# EAGLE design minimal_kl05z (EAGLE 6.6.0)
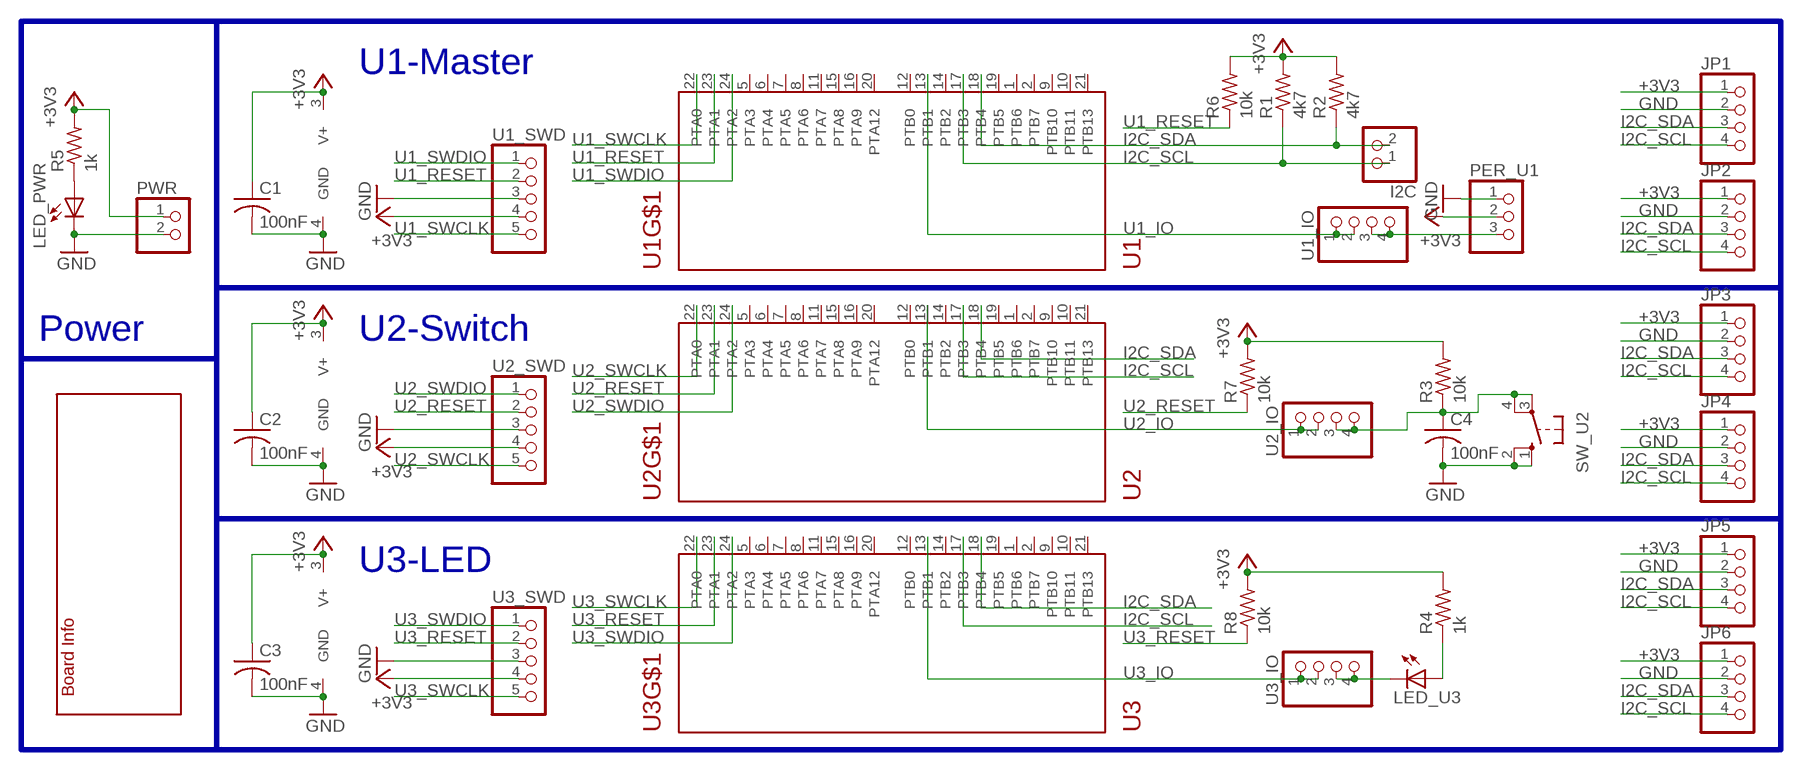
[diagram p0: schematic, sheet 1]

## Parts
C1  100nF  C-US025-025X050  [C025-025X050]
C2  100nF  C-US025-025X050  [C025-025X050]
C3  100nF  C-US025-025X050  [C025-025X050]
C4  100nF  C-US025-025X050  [C025-025X050]
I2C  PINHD-1X2  [1X02]
JP1  PINHD-1X4  [1X04]
JP2  PINHD-1X4  [1X04]
JP3  PINHD-1X4  [1X04]
JP4  PINHD-1X4  [1X04]
JP5  PINHD-1X4  [1X04]
JP6  PINHD-1X4  [1X04]
LED_PWR  LED5MM  [LED5MM]
LED_U3  LED5MM  [LED5MM]
PER_U1  PINHD-1X3  [1X03]
PWR  PINHD-1X2  [1X02]
R1  4k7  R-US_0204/7  [0204/7]
R2  4k7  R-US_0204/7  [0204/7]
R3  10k  R-US_0204/2V  [0204V]
R4  1k  R-US_0204/2V  [0204V]
R5  1k  R-US_0204/2V  [0204V]
R6  10k  R-US_0204/7  [0204/7]
R7  10k  R-US_0204/7  [0204/7]
R8  10k  R-US_0204/7  [0204/7]
SW_U2  10-XX  [B3F-10XX]
U1  MKL05Z32VFK4-DIP  [DIL24-3]
U1_IO  PINHD-1X4  [1X04]
U1_SWD  PINHD-1X5  [1X05]
U2  MKL05Z32VFK4-DIP  [DIL24-3]
U2_IO  PINHD-1X4  [1X04]
U2_SWD  PINHD-1X5  [1X05]
U3  MKL05Z32VFK4-DIP  [DIL24-3]
U3_IO  PINHD-1X4  [1X04]
U3_SWD  PINHD-1X5  [1X05]
U$1  INFO  [INFO]

## Nets
+3V3: C1.1 C2.1 C3.1 JP1.1 JP2.1 JP3.1 JP4.1 JP5.1 JP6.1 PER_U1.2 PWR.1 R1.2 R2.2 R3.2 R4.2 R5.2 R6.2 R7.2 R8.2 U1.3(V+) U1_SWD.4 U2.3(V+) U2_SWD.4 U3.3(V+) U3_SWD.4
GND: C1.2 C2.2 C3.2 C4.2 JP1.2 JP2.2 JP3.2 JP4.2 JP5.2 JP6.2 LED_PWR.K(C) PER_U1.1 PWR.2 SW_U2.1(S) SW_U2.2(S1) U1.4(GND) U1_SWD.3 U2.4(GND) U2_SWD.3 U3.4(GND) U3_SWD.3
I2C_SCL: I2C.1 JP1.4 JP2.4 JP3.4 JP4.4 JP5.4 JP6.4 R1.1 U1.17(PTB3) U2.17(PTB3) U3.17(PTB3)
I2C_SDA: I2C.2 JP1.3 JP2.3 JP3.3 JP4.3 JP5.3 JP6.3 R2.1 U1.18(PTB4) U2.18(PTB4) U3.18(PTB4)
N$1: LED_PWR.A R5.1
N$2: C4.1 R3.1 SW_U2.3(P) SW_U2.4(P1) U2_IO.3 U2_IO.4
N$3: PER_U1.3 U1_IO.3 U1_IO.4
N$4: LED_U3.A R4.1
N$5: LED_U3.K(C) U3_IO.3 U3_IO.4
U1_IO: U1.13(PTB1) U1_IO.1 U1_IO.2
U1_RESET: R6.1 U1.23(PTA1) U1_SWD.2
U1_SWCLK: U1.22(PTA0) U1_SWD.5
U1_SWDIO: U1.24(PTA2) U1_SWD.1
U2_IO: U2.13(PTB1) U2_IO.1 U2_IO.2
U2_RESET: R7.1 U2.23(PTA1) U2_SWD.2
U2_SWCLK: U2.22(PTA0) U2_SWD.5
U2_SWDIO: U2.24(PTA2) U2_SWD.1
U3_IO: U3.13(PTB1) U3_IO.1 U3_IO.2
U3_RESET: R8.1 U3.23(PTA1) U3_SWD.2
U3_SWCLK: U3.22(PTA0) U3_SWD.5
U3_SWDIO: U3.24(PTA2) U3_SWD.1
Unconnected: U1.1(PTB6) U1.2(PTB7) U1.5(PTA3) U1.6(PTA4) U1.7(PTA5) U1.8(PTA6) U1.9(PTB10) U1.10(PTB11) U1.11(PTA7) U1.12(PTB0) U1.14(PTB2) U1.15(PTA8) U1.16(PTA9) U1.19(PTB5) U1.20(PTA12) U1.21(PTB13) U2.1(PTB6) U2.2(PTB7) U2.5(PTA3) U2.6(PTA4) U2.7(PTA5) U2.8(PTA6) U2.9(PTB10) U2.10(PTB11) U2.11(PTA7) U2.12(PTB0) U2.14(PTB2) U2.15(PTA8) U2.16(PTA9) U2.19(PTB5) U2.20(PTA12) U2.21(PTB13) U3.1(PTB6) U3.2(PTB7) U3.5(PTA3) U3.6(PTA4) U3.7(PTA5) U3.8(PTA6) U3.9(PTB10) U3.10(PTB11) U3.11(PTA7) U3.12(PTB0) U3.14(PTB2) U3.15(PTA8) U3.16(PTA9) U3.19(PTB5) U3.20(PTA12) U3.21(PTB13)

## Buses
B$1

## Notes on the sheet
- U1-Master
- Power | U2-Switch
- U3-LED

## Library data of the parts
C1-C4 = rcl:C-US: CAPACITOR, American symbol
I2C PWR = pinhead:PINHD-1X2: PIN HEADER
JP1-JP6 U1_IO U2_IO U3_IO = pinhead:PINHD-1X4: PIN HEADER
LED_PWR LED_U3 = led:LED: LED OSRAM: - CHIPLED LG R971, LG N971, LY N971, LG Q971, LY Q971, LO R971, LY R971 LH N974, LH R974 LS Q976, LO Q976, LY Q976 LO Q996 - Hyper CHIPLED LW Q18S LB Q993, LB Q99A, LB R99A - SideLED LS A670, LO A670, LY A670, LG A670, LP A670 LB A673, LV A673, LT A673, LW A673 LH A674 LY A675 LS A676, LA A676, LO A676, LY A676, LW A676 LS A679, LY A679, LG A679 - Hyper Micro SIDELED® LS Y876, LA Y876, LO Y876, LY Y876 LT Y87S - SmartLED LW L88C, LW L88S LB L89C, LB L89S, LG L890 LS L89K, LO L89K, LY L89K LS L896, LA L896, LO L896, LY L896 - TOPLED LS T670, LO T670, LY T670, LG T670, LP T670 LSG T670, LSP T670, LSY T670, LOP T670, LYG T670 LG T671, LOG T671, LSG T671 LB T673, LV T673, LT T673, LW T673 LH T674 LS T676, LA T676, LO T676, LY T676, LB T676, LH T676, LSB T676, LW T676 LB T67C, LV T67C, LT T67C, LS T67K, LO T67K, LY T67K, LW E67C LS E67B, LA E67B, LO E67B, LY E67B, LB E67C, LV E67C, LT E67C LW T67C LS T679, LY T679, LG T679 LS T770, LO T770, LY T770, LG T770, LP T770 LB T773, LV T773, LT T773, LW T773 LH T774 LS E675, LA E675, LY E675, LS T675 LS T776, LA T776, LO T776, LY T776, LB T776 LHGB T686 LT T68C, LB T68C - Hyper Mini TOPLED® LB M676 - Mini TOPLED Santana® LG M470 LS M47K, LO M47K, LY M47K Source: http://www.osram.convergy.de LUXEON: - LUMILED® LXK2-PW12-R00, LXK2-PW12-S00, LXK2-PW14-U00, LXK2-PW14-V00 LXK2-PM12-R00, LXK2-PM12-S00, LXK2-PM14-U00 LXK2-PE12-Q00, LXK2-PE12-R00, LXK2-PE12-S00, LXK2-PE14-T00, LXK2-PE14-U00 LXK2-PB12-K00, LXK2-PB12-L00, LXK2-PB12-M00, LXK2-PB14-N00, LXK2-PB14-P00, LXK2-PB14-Q00 LXK2-PR12-L00, LXK2-PR12-M00, LXK2-PR14-Q00, LXK2-PR14-R00 LXK2-PD12-Q00, LXK2-PD12-R00, LXK2-PD12-S00 LXK2-PH12-R00, LXK2-PH12-S00 LXK2-PL12-P00, LXK2-PL12-Q00, LXK2-PL12-R00 Source: www.luxeon.com KINGBRIGHT: KA-3528ASYC Source: www.kingbright.com
PER_U1 = pinhead:PINHD-1X3: PIN HEADER
R1-R8 = rcl:R-US_: RESISTOR, American symbol
SW_U2 = switch-omron:10-XX: OMRON SWITCH; MPN: B3F-1000; OC_FARNELL: 176432; OC_NEWARK: 36M3542
U1-U3 = modular_robotics:MKL05Z32VFK4
U1_SWD U2_SWD U3_SWD = pinhead:PINHD-1X5: PIN HEADER
U$1 = modular_robotics:INFO; AUTHOR: Austin Buchan; DATE: Jul 7, 2015; DESIGN: MinimalKL05Z; ORGANIZATION: UC Berkeley ASPIRE; REVISION: r0.0

## Board
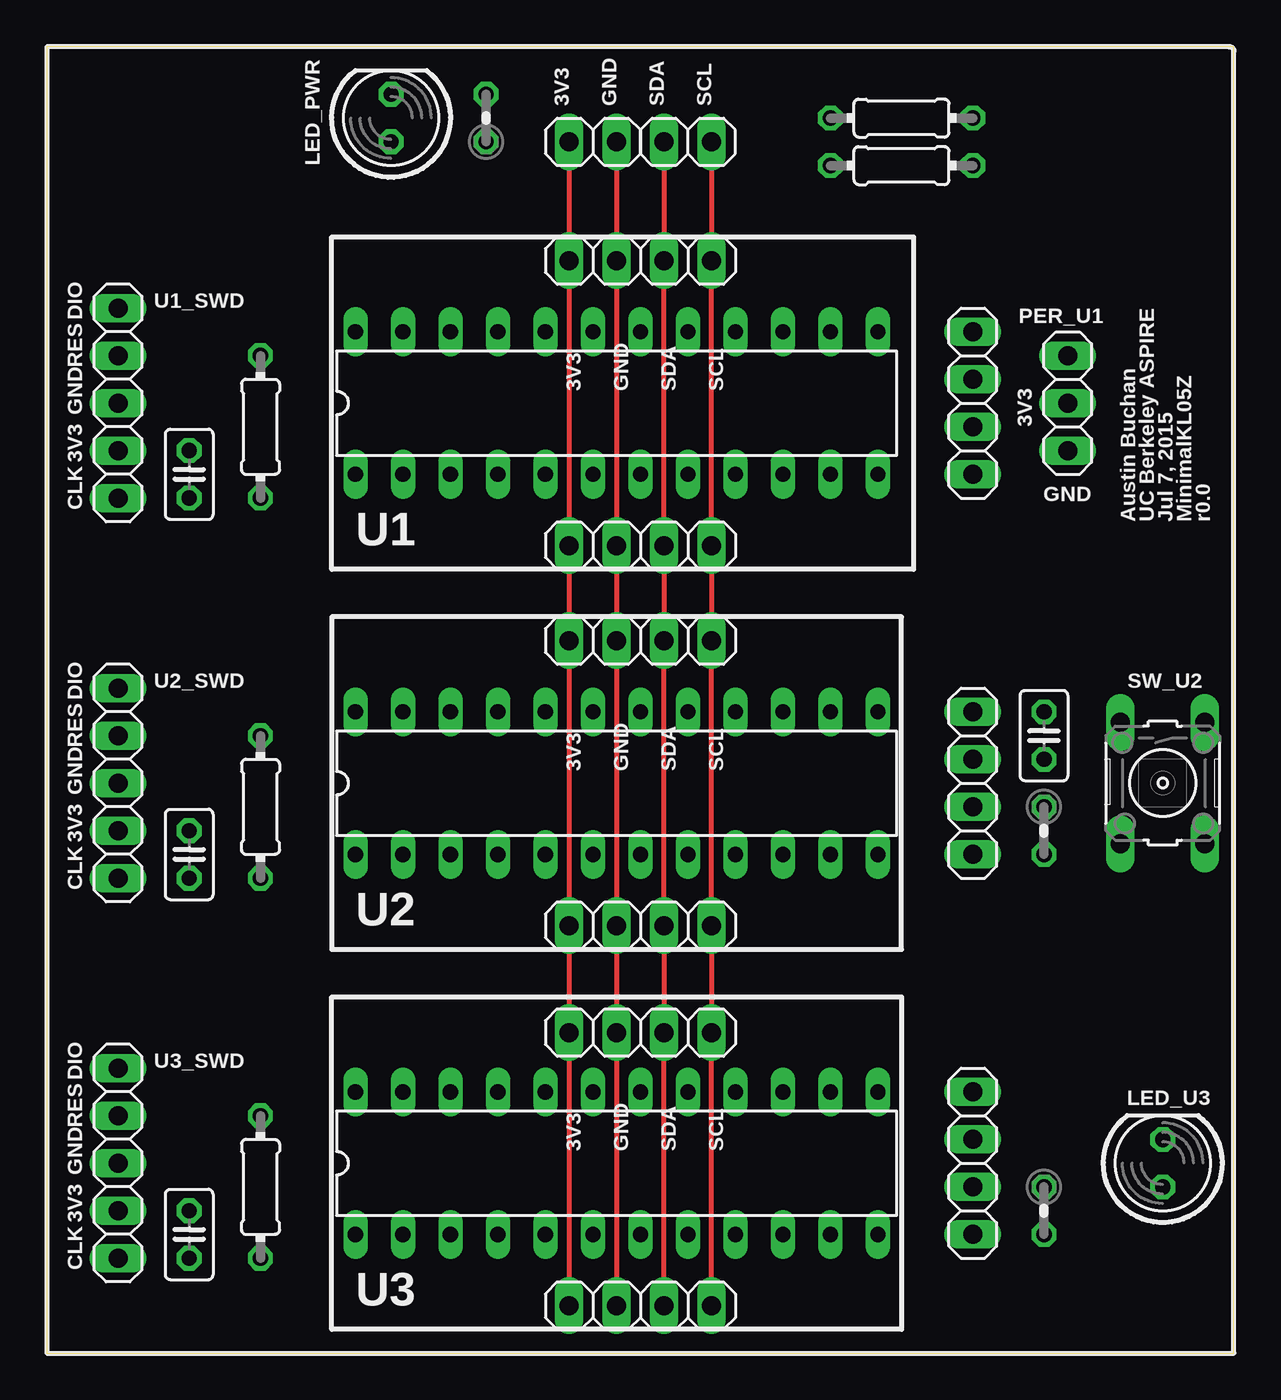
[diagram p1: board, top side]
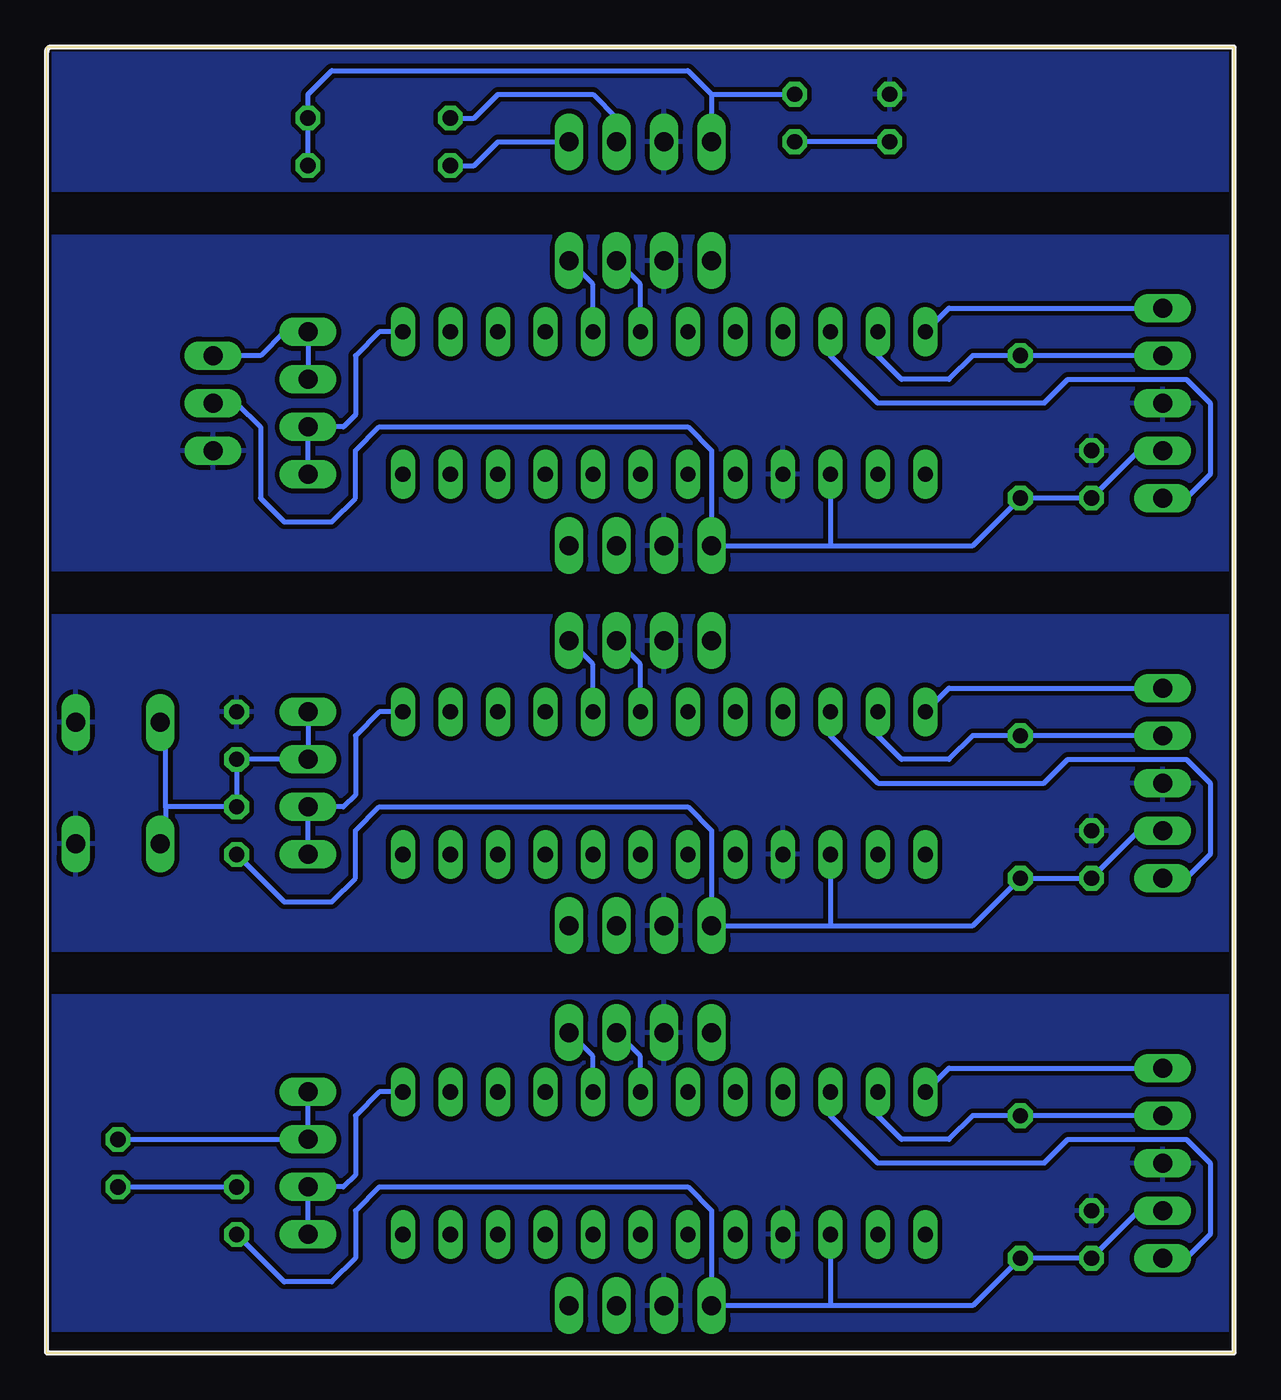
[diagram p2: board, bottom side, seen from below]

Size 63.5 x 69.85 mm. Coordinates in mm from the lower left corner, seen from the top.
Outline: 0,0 63.5,0 63.5,69.85 0,69.85 0,0
Copper layers (1*16): Top 0.035mm / dielectric 1.5mm / Bottom 0.035mm
Design rules "default *": minimum track width 10mil, minimum drill 24mil, track to track 10mil, track to pad 10mil, pad to pad 10mil, via to via 10mil, smd to smd 10mil, copper to edge 10mil, drill to drill 10mil, minimum pad ring 10mil, minimum via ring 8mil, stop-mask expansion 4mil, vias tented up to drill 0mil, thermal gap 10mil

### Footprints (pad centres in the part's own frame; a part is rotated, then mirrored left to right if it is on the bottom)
C025-025X050 = drill 0.813 octagon: 1 -1.27,0; 2 1.27,0
1X02 = drill 1.016 long: 1 -1.27,0; 2 1.27,0
1X04 = drill 1.016 long: 1 -3.81,0; 2 -1.27,0; 3 1.27,0; 4 3.81,0
LED5MM = drill 0.813 octagon: A -1.27,0; K 1.27,0
1X03 = drill 1.016 long: 1 -2.54,0; 2 0,0; 3 2.54,0
0204/7 = drill 0.813 octagon: 1 -3.81,0; 2 3.81,0
0204V = drill 0.813 octagon: 1 -1.27,0; 2 1.27,0
B3F-10XX = drill 1.016 long: 1 -3.251,2.261; 2 3.251,2.261; 3 -3.251,-2.261; 4 3.251,-2.261
DIL24-3 = drill 0.813 long: 1 -13.97,-3.81; 2 -11.43,-3.81; 3 -8.89,-3.81; 4 -6.35,-3.81; 5 -3.81,-3.81; 6 -1.27,-3.81; 7 1.27,-3.81; 8 3.81,-3.81; 9 6.35,-3.81; 10 8.89,-3.81; 11 11.43,-3.81; 12 13.97,-3.81; 13 13.97,3.81; 14 11.43,3.81; 15 8.89,3.81; 16 6.35,3.81; 17 3.81,3.81; 18 1.27,3.81; 19 -1.27,3.81; 20 -3.81,3.81; 21 -6.35,3.81; 22 -8.89,3.81; 23 -11.43,3.81; 24 -13.97,3.81
1X05 = drill 1.016 long: 1 -5.08,0; 2 -2.54,0; 3 0,0; 4 2.54,0; 5 5.08,0

### Placement (x,y rotation side)
C1  7.62,46.99 90 top
C2  7.62,26.67 90 top
C3  7.62,6.35 90 top
C4  53.34,33.02 90 top
I2C  34.29,64.77 180 top
JP1  31.75,58.42 0 top
JP2  31.75,43.18 0 top
JP3  31.75,38.1 0 top
JP4  31.75,22.86 0 top
JP5  31.75,17.14 0 top
JP6  31.75,2.54 0 top
LED_PWR  18.41,66.04 90 top
LED_U3  59.69,10.16 90 top
PER_U1  54.61,50.8 90 top
PWR  29.21,64.77 0 top
R1  45.72,63.5 0 top
R2  45.72,66.04 0 top
R3  53.34,27.94 270 top
R4  53.34,7.62 270 top
R5  23.5,66.04 90 top
R6  11.43,49.53 270 top
R7  11.43,29.21 270 top
R8  11.43,8.89 270 top
SW_U2  59.69,30.48 270 top
U1  30.48,50.8 0 top
U1_IO  49.53,50.8 90 top
U1_SWD  3.81,50.8 270 top
U2  30.48,30.48 0 top
U2_IO  49.53,30.48 90 top
U2_SWD  3.81,30.48 270 top
U3  30.48,10.16 0 top
U3_IO  49.53,10.16 90 top
U3_SWD  3.81,10.16 270 top
U$1  62.23,44.45 90 top

### Tracks (layer width: path | path; a pad name or v marks a point on that pad's centre or on a via)
+3V3
  Top 0.254: PWR.1 JP1.1 JP2.1 JP3.1 JP4.1 27.94,18.41 28.57,17.78 JP5.1 JP6.1
  Bottom 0.254: 27.94,67.31 29.21,68.58 48.26,68.58 49.53,67.31 R2.2 R1.2 | 27.94,67.31 PWR.1 | U1_SWD.4 5.08,48.26 C1.1 R6.2 13.97,43.18 21.59,43.18 | 27.94,67.31 R5.2 | PER_U1.2 53.34,50.8 52.07,49.53 52.07,45.72 50.8,44.45 48.26,44.45 46.99,45.72 46.99,48.26 45.72,49.53 29.21,49.53 27.94,48.26 JP2.1 21.59,43.18 | U2_SWD.4 5.08,27.94 C2.1 R7.2 13.97,22.86 21.59,22.86 | R3.2 50.8,24.13 48.26,24.13 46.99,25.4 46.99,27.94 45.72,29.21 29.21,29.21 27.94,27.94 JP4.1 21.59,22.86 | R4.2 50.8,3.81 48.26,3.81 46.99,5.08 46.99,7.62 45.72,8.89 29.21,8.89 27.94,7.62 JP6.1 21.59,2.54 | U3_SWD.4 5.08,7.62 C3.1 R8.2 13.97,2.54 21.59,2.54 | U1.3 21.59,43.18 | U2.3 21.59,22.86 | U3.3 21.59,2.54
GND
  Top 0.254: PWR.2 JP1.2 JP2.2 JP3.2 JP4.2 JP5.2 JP6.2
  pour Bottom (isolate 0.254): 0,41.91 63.5,41.91 63.5,59.69 0,59.69
  pour Bottom: 0,69.85 63.5,69.85 63.5,62.23 0,62.23
  pour Bottom (isolate 0.254): 0,39.37 63.5,39.37 63.5,21.59 0,21.59
  pour Bottom (isolate 0.254): 0,19.05 63.5,19.05 63.5,1.27 0,1.27
I2C_SCL
  Top 0.254: I2C.1 JP1.4 JP2.4 JP3.4 JP4.4 JP5.4 JP6.4
  Bottom 0.254: R1.1 40.64,63.5 39.37,64.77 I2C.1 | U2.17 34.29,36.83 JP3.4 | U1.17 34.29,57.15 JP1.4 | U3.17 34.29,15.88 JP5.4
I2C_SDA
  Top 0.254: I2C.2 JP1.3 JP2.3 JP3.3 JP4.3 JP5.3 JP6.3
  Bottom 0.254: R2.1 40.64,66.04 39.37,67.31 34.29,67.31 33.02,66.04 I2C.2 | U2.18 31.75,36.83 JP3.3 | U1.18 31.75,57.15 JP1.3 | U3.18 31.75,15.88 JP5.3
N$1
  Bottom 0.254: LED_PWR.A R5.1
N$2
  Bottom 0.254: U2_IO.4 U2_IO.3 C4.1 R3.1 57.15,29.21 | 57.15,29.21 57.15,33.45 SW_U2.3 | 57.15,29.21 57.15,27.51 SW_U2.4
N$3
  Bottom 0.254: U1_IO.3 U1_IO.4 50.8,54.61 52.07,53.34 PER_U1.3
N$4
  Bottom 0.254: LED_U3.A R4.1
N$5
  Bottom 0.254: U3_IO.4 U3_IO.3 LED_U3.K
U1_IO
  Bottom 0.254: U1_IO.1 U1_IO.2 47.62,49.53 46.99,50.16 46.99,53.34 45.72,54.61 U1.13
U1_RESET
  Bottom 0.254: U1_SWD.2 R6.1 13.97,53.34 15.24,52.07 17.78,52.07 19.05,53.34 U1.23
U1_SWCLK
  Bottom 0.254: U1_SWD.5 2.54,45.72 1.27,46.99 1.27,50.8 2.54,52.07 8.89,52.07 10.16,50.8 19.05,50.8 21.59,53.34 U1.22
U1_SWDIO
  Bottom 0.254: U1_SWD.1 15.24,55.88 U1.24
U2_IO
  Bottom 0.254: U2_IO.1 U2_IO.2 47.62,29.21 46.99,29.84 46.99,33.02 45.72,34.29 U2.13
U2_RESET
  Bottom 0.254: U2_SWD.2 R7.1 13.97,33.02 15.24,31.75 17.78,31.75 19.05,33.02 U2.23
U2_SWCLK
  Bottom 0.254: U2_SWD.5 2.54,25.4 1.27,26.67 1.27,30.48 2.54,31.75 8.89,31.75 10.16,30.48 19.05,30.48 21.59,33.02 U2.22
U2_SWDIO
  Bottom 0.254: U2_SWD.1 15.24,35.56 U2.24
U3_IO
  Bottom 0.254: U3_IO.1 U3_IO.2 47.62,8.89 46.99,9.53 46.99,12.7 45.72,13.97 U3.13
U3_RESET
  Bottom 0.254: U3_SWD.2 R8.1 13.97,12.7 15.24,11.43 17.78,11.43 19.05,12.7 U3.23
U3_SWCLK
  Bottom 0.254: U3_SWD.5 2.54,5.08 1.27,6.35 1.27,10.16 2.54,11.43 8.89,11.43 10.16,10.16 19.05,10.16 21.59,12.7 U3.22
U3_SWDIO
  Bottom 0.254: U3_SWD.1 15.24,15.24 U3.24

### Text on the board
tPlace: 3V3 | GND | SDA | SCL | DIO | RES | 3V3 | GND | SDA | SCL | GND | 3V3 | 3V3 | GND | CLK | DIO | RES | 3V3 | GND | SDA | SCL | GND | 3V3 | CLK | DIO | RES | 3V3 | GND | SDA | SCL | GND | 3V3 | CLK